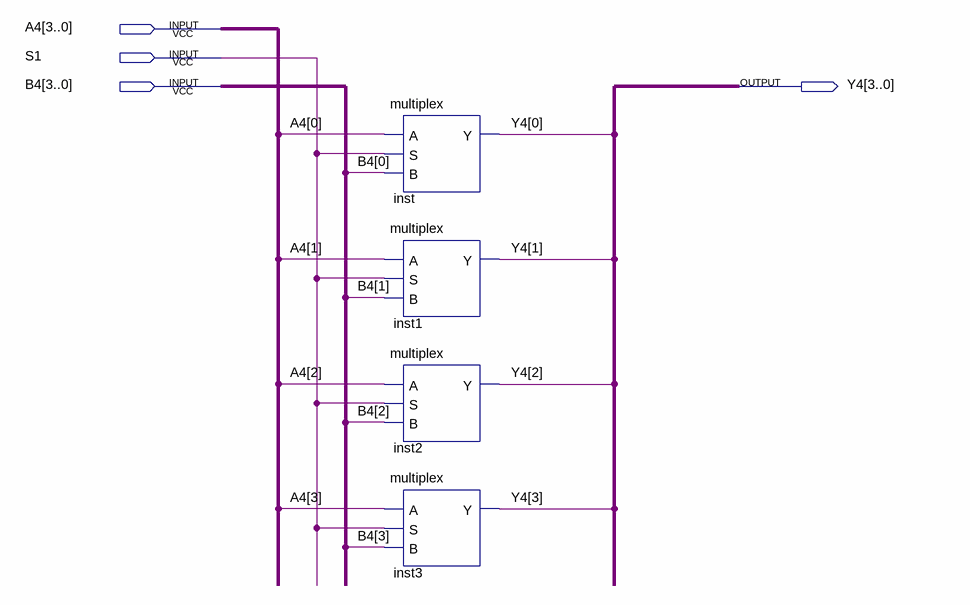
[diagram p0: schematic sheet]
// Quartus schematic multiplex4.bdf as structural Verilog: 4 symbols, 4 pins
module multiplex4 (
  input  [3:0] A4,
  input  S1,
  input  [3:0] B4,
  output [3:0] Y4
);

  multiplex inst (.A(A4[0]), .S(S1), .B(B4[0]), .Y(Y4[0]));
  multiplex inst1 (.A(A4[1]), .S(S1), .B(B4[1]), .Y(Y4[1]));
  multiplex inst2 (.A(A4[2]), .S(S1), .B(B4[2]), .Y(Y4[2]));
  multiplex inst3 (.A(A4[3]), .S(S1), .B(B4[3]), .Y(Y4[3]));
endmodule
